# EAGLE design recieving end copy-1 (EAGLE 6.3)
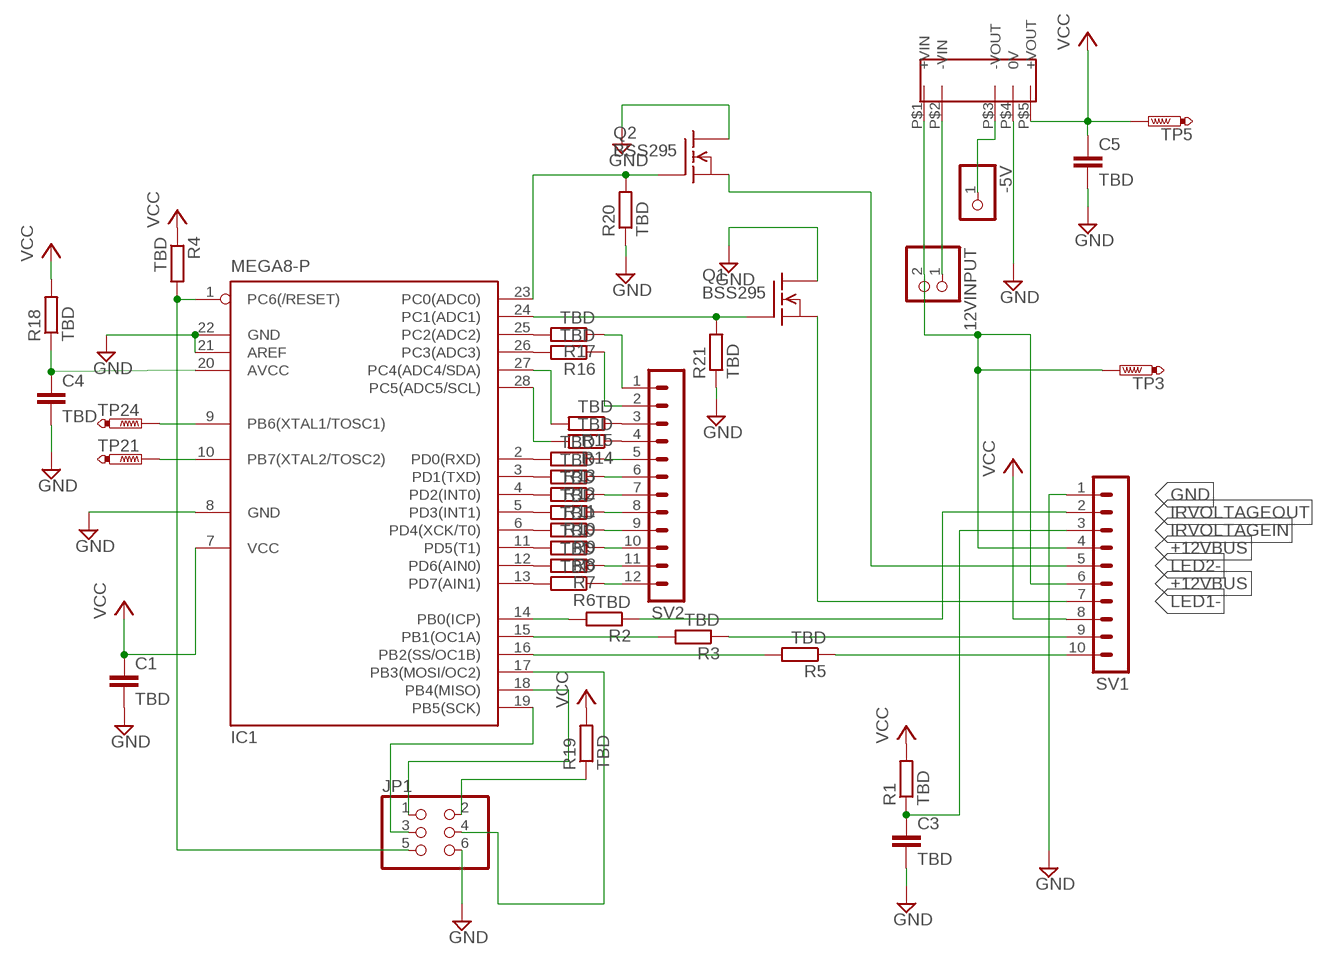
[diagram p0: schematic, sheet 1]

## Parts
12VINPUT  PINHD-1X2  [1X02]
-5V  PINHD-1X1  [1X01]
C1  TBD  C-EUC0805  [C0805]
C3  TBD  C-EUC0805  [C0805]
C4  TBD  C-EUC0805  [C0805]
C5  TBD  C-EUC0805  [C0805]
IC1  MEGA8-P  [DIL28-3]
JP1  PINHD-2X3  [2X03]
Q1  BSS295  [TO92]
Q2  BSS295  [TO92]
R1  TBD  R-EU_R0805  [R0805]
R2  TBD  R-EU_R0805  [R0805]
R3  TBD  R-EU_R0805  [R0805]
R4  TBD  R-EU_R0805  [R0805]
R5  TBD  R-EU_R0805  [R0805]
R6  TBD  R-EU_R0805  [R0805]
R7  TBD  R-EU_R0805  [R0805]
R8  TBD  R-EU_R0805  [R0805]
R9  TBD  R-EU_R0805  [R0805]
R10  TBD  R-EU_R0805  [R0805]
R11  TBD  R-EU_R0805  [R0805]
R12  TBD  R-EU_R0805  [R0805]
R13  TBD  R-EU_R0805  [R0805]
R14  TBD  R-EU_R0805  [R0805]
R15  TBD  R-EU_R0805  [R0805]
R16  TBD  R-EU_R0805  [R0805]
R17  TBD  R-EU_R0805  [R0805]
R18  TBD  R-EU_R0805  [R0805]
R19  TBD  R-EU_R0805  [R0805]
R20  TBD  R-EU_R0805  [R0805]
R21  TBD  R-EU_R0805  [R0805]
SV1  MA10-1  [MA10-1]
SV2  MA12-1  [MA12-1]
TP3  PTR1B1,27  [B1,27]
TP5  PTR1B1,27  [B1,27]
TP21  PTR1B1,27  [B1,27]
TP24  PTR1B1,27  [B1,27]
U$1  NKA1205SC  [NKA1205SC]

## Nets
0VBUS: 12VINPUT.1 U$1.P$2(-VIN)
+12VBUS: 12VINPUT.2 SV1.4 SV1.6 TP3.TP U$1.P$1(+VIN)
GND: C1.2 C3.2 C4.2 C5.2 IC1.8(GND) IC1.21(AREF) IC1.22(GND) JP1.6 Q1.2(D) Q2.2(D) R20.1 R21.1 SV1.1 U$1.P$4(0V)
IRVOLTAGEIN: C3.1 R1.1 SV1.3
IRVOLTAGEOUT: R2.1 SV1.2
LED1-: Q1.3(S) SV1.7
LED2-: Q2.3(S) SV1.5
N$1: IC1.24(PC1(ADC1)) Q1.1(G) R21.2
N$2: R3.1 SV1.9
N$3: R17.1 SV2.1
N$4: R16.1 SV2.2
N$5: IC1.17(PB3(MOSI/OC2)) JP1.4
N$6: IC1.27(PC4(ADC4/SDA)) R15.2
N$7: IC1.28(PC5(ADC5/SCL)) R14.2
N$8: IC1.23(PC0(ADC0)) Q2.1(G) R20.2
N$9: R5.1 SV1.10
N$10: R13.1 SV2.5
N$11: IC1.14(PB0(ICP)) R2.2
N$12: R12.1 SV2.6
N$13: R11.1 SV2.7
N$14: R10.1 SV2.8
N$15: R9.1 SV2.9
N$16: R8.1 SV2.10
N$17: R7.1 SV2.11
N$18: IC1.15(PB1(OC1A)) R3.2
N$19: IC1.16(PB2(SS/OC1B)) R5.2
N$22: R6.1 SV2.12
N$23: IC1.25(PC2(ADC2)) R17.2
N$24: IC1.26(PC3(ADC3)) R16.2
N$25: R15.1 SV2.3
N$26: R14.1 SV2.4
N$27: IC1.2(PD0(RXD)) R13.2
N$28: IC1.6(PD4(XCK/T0)) R9.2
N$29: IC1.18(PB4(MISO)) JP1.1
N$30: IC1.19(PB5(SCK)) JP1.3
N$31: IC1.9(PB6(XTAL1/TOSC1)) TP24.TP
N$32: IC1.10(PB7(XTAL2/TOSC2)) TP21.TP
N$33: IC1.11(PD5(T1)) R8.2
N$34: IC1.12(PD6(AIN0)) R7.2
N$35: IC1.1(PC6(/RESET)) JP1.5 R4.2
N$36: IC1.13(PD7(AIN1)) R6.2
N$37: IC1.3(PD1(TXD)) R12.2
N$38: IC1.4(PD2(INT0)) R11.2
N$39: IC1.5(PD3(INT1)) R10.2
N$41: C4.1 IC1.20(AVCC) R18.1
N$43: JP1.2 R19.1
N$46: -5V.1 U$1.P$3(-VOUT)
VCC: C1.1 C5.1 IC1.7(VCC) R1.2 R4.1 R18.2 R19.2 SV1.8 TP5.TP U$1.P$5(+VOUT)

## Library data of the parts
12VINPUT = pinhead:PINHD-1X2: PIN HEADER
-5V = pinhead:PINHD-1X1: PIN HEADER
C1 C3-C5 = rcl:C-EU: CAPACITOR, European symbol
IC1 = atmel:MEGA8-P: MICROCONTROLLER 8 Kbytes FLASH, 1 kbytes SRAM, 512 bytes EEPROM, USART, 4-channel 10 bit ADC, 2-channel 8 bit ADC Pin compatible with Atmega48, ATMega88, ATMega168 Source: avr.lbr; OC_FARNELL: unknown; OC_NEWARK: unknown
JP1 = pinhead:PINHD-2X3: PIN HEADER
Q1 Q2 = transistor-fet:BSS295: N-Channel Enhancement MOSFET not checked
R1-R21 = resistor:R-EU_: RESISTOR, European symbol
SV1 = con-lstb:MA10-1: PIN HEADER; OC_FARNELL: unknown; OC_NEWARK: unknown
SV2 = con-lstb:MA12-1: PIN HEADER; OC_FARNELL: unknown; OC_NEWARK: unknown
TP3 TP5 TP21 TP24 = testpad:PTR1: TEST PIN
U$1 = nka1205sc:NKA1205SC

## Board
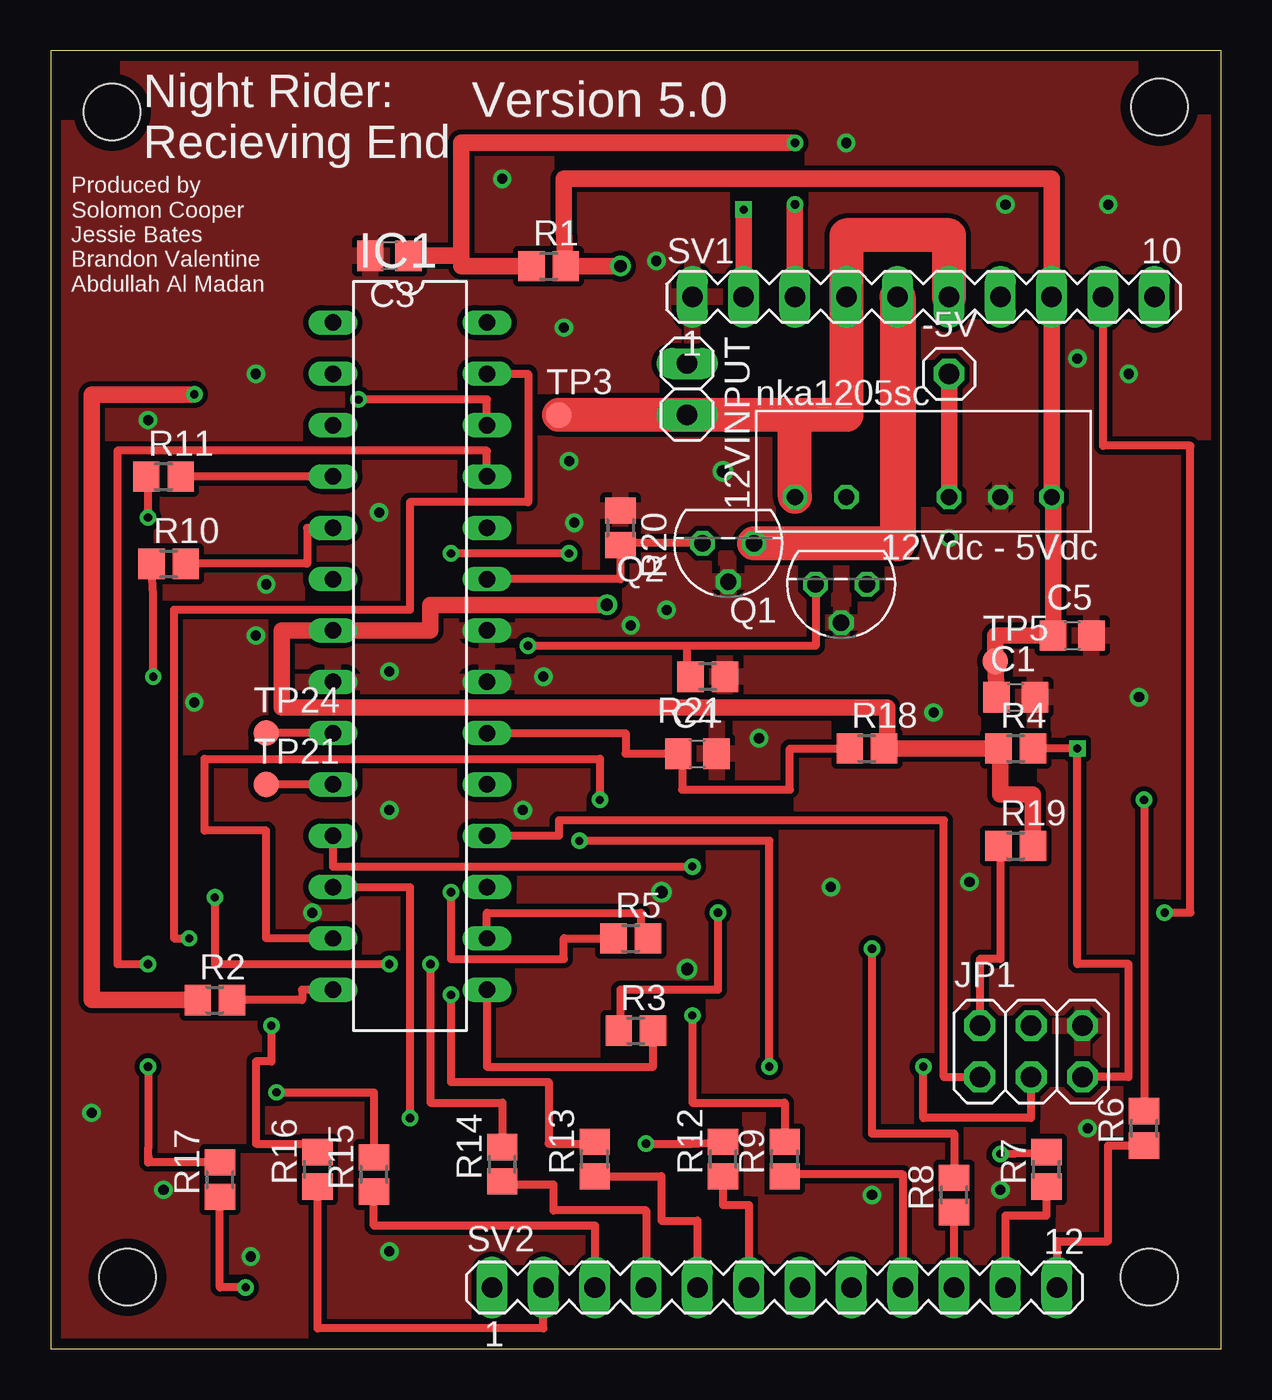
[diagram p1: board, top side]
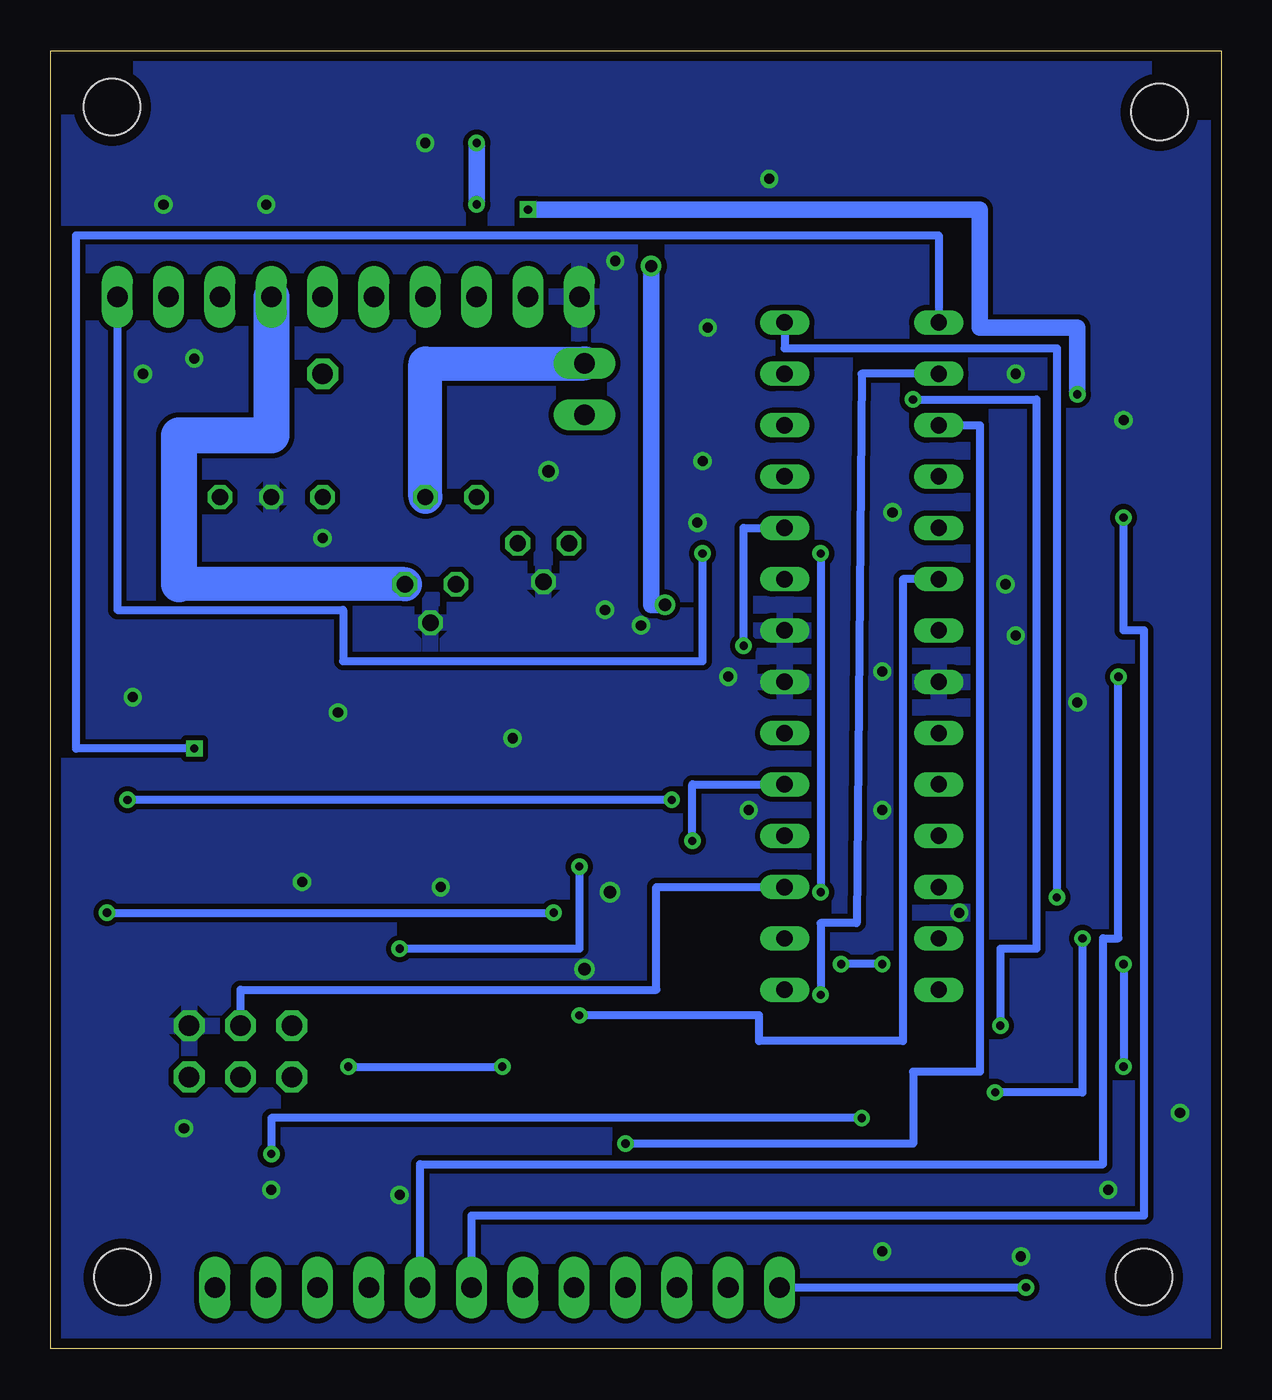
[diagram p2: board, bottom side, seen from below]

Size 57.91 x 64.26 mm. Coordinates in mm from the lower left corner, seen from the top.
Outline: 0,0 57.91,0 57.91,64.26 0,64.26 0,0
Copper layers (1*16): Top 0.0178mm / dielectric 59mil / Bottom 0.0178mm
Design rules "sunstone-valueproto": minimum track width 7mil, minimum drill 16mil, track to track 7mil, track to pad 7mil, pad to pad 7mil, via to via 7mil, smd to smd 7mil, copper to edge 20mil, drill to drill 16mil, minimum pad ring 8mil, minimum via ring 8mil, stop-mask expansion 3mil, vias tented up to drill 0mil, thermal gap 10mil
Holes 2.8 mm at 3.05,61.21 54.86,61.47 54.36,3.56 3.81,3.56

### Footprints (pad centres in the part's own frame; a part is rotated, then mirrored left to right if it is on the bottom)
1X02 = drill 1.016 long: 1 -1.27,0; 2 1.27,0
1X01 = drill 1.016 octagon: 1 0,0
C0805 = smd 1.3 x 1.5: 1 -0.95,0; 2 0.95,0
DIL28-3 = drill 0.813 long: 1 -16.51,-3.81; 2 -13.97,-3.81; 3 -11.43,-3.81; 4 -8.89,-3.81; 5 -6.35,-3.81; 6 -3.81,-3.81; 7 -1.27,-3.81; 8 1.27,-3.81; 9 3.81,-3.81; 10 6.35,-3.81; 11 8.89,-3.81; 12 11.43,-3.81; 13 13.97,-3.81; 14 16.51,-3.81; 15 16.51,3.81; 16 13.97,3.81; 17 11.43,3.81; 18 8.89,3.81; 19 6.35,3.81; 20 3.81,3.81; 21 1.27,3.81; 22 -1.27,3.81; 23 -3.81,3.81; 24 -6.35,3.81; 25 -8.89,3.81; 26 -11.43,3.81; 27 -13.97,3.81; 28 -16.51,3.81
2X03 = drill 1.016 octagon: 1 -2.54,-1.27; 2 -2.54,1.27; 3 0,-1.27; 4 0,1.27; 5 2.54,-1.27; 6 2.54,1.27
TO92 = drill 0.813 octagon: 1 1.27,0; 2 0,1.905; 3 -1.27,0
R0805 = smd 1.3 x 1.5: 1 -0.85,0; 2 0.85,0
MA10-1 = drill 1.016 long: 1 -11.43,0; 2 -8.89,0; 3 -6.35,0; 4 -3.81,0; 5 -1.27,0; 6 1.27,0; 7 3.81,0; 8 6.35,0; 9 8.89,0; 10 11.43,0
MA12-1 = drill 1.016 long: 1 -13.97,0; 2 -11.43,0; 3 -8.89,0; 4 -6.35,0; 5 -3.81,0; 6 -1.27,0; 7 1.27,0; 8 3.81,0; 9 6.35,0; 10 8.89,0; 11 11.43,0; 12 13.97,0
B1,27 = smd 1.27 x 1.27: TP 0,0
NKA1205SC = drill 0.8 octagon: P$1 -6.35,-1.27; P$2 -3.81,-1.27; P$3 1.27,-1.27; P$4 3.81,-1.27; P$5 6.35,-1.27

### Placement (x,y rotation side)
12VINPUT  31.5,47.5 270 top
-5V  44.45,48.26 0 top
C1  47.75,32.26 0 top
C3  16.76,54.1 180 top
C4  32,29.46 0 top
C5  50.55,35.31 0 top
IC1  17.78,34.29 270 top
JP1  48.51,14.73 0 top
Q1  39.12,37.85 180 top
Q2  33.53,39.88 180 top
R1  24.64,53.59 0 top
R2  8.13,17.27 0 top
R3  28.96,15.75 0 top
R4  47.75,29.72 0 top
R5  28.7,20.32 0 top
R6  54.1,10.92 90 top
R7  49.28,8.89 90 top
R8  44.7,7.62 90 top
R9  36.32,9.4 90 top
R10  5.84,38.86 0 top
R11  5.59,43.18 0 top
R12  33.27,9.4 90 top
R13  26.92,9.4 90 top
R14  22.35,9.14 90 top
R15  16,8.64 90 top
R16  13.21,8.89 90 top
R17  8.38,8.38 90 top
R18  40.39,29.72 0 top
R19  47.75,24.89 0 top
R20  28.19,40.64 270 top
R21  32.51,33.27 180 top
SV1  43.18,52.07 0 top
SV2  35.81,3.05 0 top
TP3  25.15,46.23 0 top
TP5  46.74,34.04 0 top
TP21  10.67,27.94 0 top
TP24  10.67,30.48 0 top
U$1  43.18,43.43 0 top

### Tracks (layer width: path | path; a pad name or v marks a point on that pad's centre or on a via)
0VBUS
  Bottom 1.676: U$1.P$2 39.37,48.77 12VINPUT.1
+12VBUS
  Top 1.676: U$1.P$1 36.83,46.23 | 36.83,46.23 12VINPUT.2 TP3.TP | 36.83,46.23 39.37,46.23 SV1.4 39.37,55.12 44.45,55.12 SV1.6
GND  (via drill 0.5, 0.61)
  other vias: 39.37,59.69 4.83,45.97 52.32,56.64 44.45,40.13 53.34,48.26 25.65,43.94 47.24,56.64 33.27,43.43 50.8,49.02 22.35,57.91 2.03,11.68 30.48,36.58 10.16,48.26 25.91,40.89 43.69,31.5 35.05,30.23 38.61,22.86 53.85,32.26 24.38,33.27 45.47,23.11 23.37,26.67 10.67,37.85 10.16,35.31 7.11,32 31.5,18.8 12.95,21.59 46.99,7.87 40.64,7.62 16.76,4.83 9.91,4.57 5.59,7.87 51.31,10.92 29.97,53.85 25.4,50.55 16.76,33.53 16.76,26.67 16.26,41.4 30.23,22.61 28.7,35.81
  pour Bottom (isolate 0.254): 0,0 57.66,-0.25 57.91,64.26 0,64.01
  pour Top (isolate 0.254): 0,0 57.66,-0.25 57.91,64.26 0,64.01
IRVOLTAGEIN  (via drill 0.41)
  Top 0.178: 23.88,54.1 23.79,54.1 R1.1
  Top 0.813: SV1.3 v36.83,56.64 | v36.83,59.69 20.32,59.69 20.32,54.1 | C3.1 20.32,54.1 | 20.32,54.1 20.32,53.59 R1.1
  Bottom 0.813: v36.83,56.64 v36.83,59.69
IRVOLTAGEOUT  (via drill 0.41)
  Top 0.813: SV1.2 v34.29,56.39 | v7.11,47.24 2.03,47.24 2.03,17.27 R2.1
  Bottom 0.813: v34.29,56.39 11.94,56.39 11.94,50.55 7.11,50.55 v7.11,47.24
LED1-
  Bottom 1.676: Q1.3 51.56,37.85
  Bottom 1.778: SV1.7 46.99,45.21 51.56,45.21 51.56,37.85
LED2-
  Top 1.676: Q2.3 41.91,39.88
  Top 1.778: SV1.5 41.91,39.88
N$1  (via drill 0.41)
  Top 0.406: R21.2 31.5,33.02 31.5,34.8 | 31.5,34.8 v23.62,34.8 | Q1.1 37.85,34.8 31.5,34.8
  Bottom 0.406: IC1.24 23.62,40.64 v23.62,34.8
N$2  (via drill 0.41)
  Top 0.406: v33.02,21.59 33.02,17.78 28.19,17.78 28.19,16.51 R3.1 | v55.12,21.59 56.39,21.59 56.39,44.7 52.07,44.7 SV1.9
  Bottom 0.406: v55.12,21.59 v33.02,21.59
N$3  (via drill 0.41)
  Top 0.406: v9.65,3.05 8.38,3.05 R17.1
  Bottom 0.406: SV2.1 v9.65,3.05
N$4
  Top 0.406: R16.1 13.21,1.02 24.38,1.02 SV2.2
N$5
  Bottom 0.406: IC1.17 27.94,22.86 27.94,17.78 48.51,17.78 JP1.4
N$6  (via drill 0.41)
  Top 0.406: R15.2 16,12.7 v11.18,12.7 | v6.86,20.32 6.1,20.32 6.1,36.58 17.78,36.58 17.78,41.91 23.62,41.91 23.62,48.26 IC1.27
  Bottom 0.406: v6.86,20.32 6.86,12.7 v11.18,12.7
N$7  (via drill 0.41)
  Top 0.406: v18.8,19.05 18.8,12.19 22.35,12.19 R14.2 | v16.76,19.05 8.13,19.05 v8.13,22.35
  Bottom 0.406: v16.76,19.05 v18.8,19.05 | v8.13,22.35 8.13,49.53 21.59,49.53 IC1.28
N$8
  Top 0.406: IC1.23 28.19,38.1 R20.2 28.19,39.88 Q2.1
N$9  (via drill 0.41)
  Top 0.178: 27.94,20.32 R5.1
  Top 0.406: R5.1 25.4,20.32 25.4,19.3 19.81,19.3 v19.81,22.61 | v25.65,39.37 v19.81,39.37
  Bottom 0.406: v19.81,39.37 v19.81,22.61 | SV1.10 54.61,36.58 43.43,36.58 43.43,34.04 25.65,34.04 v25.65,39.37
N$10
  Top 0.406: R13.1 30.23,8.55 30.23,6.35 32,6.35 SV2.5
N$11
  Top 0.406: IC1.14 12.45,17.78 12.45,17.27 R2.2
N$12
  Top 0.406: R12.1 33.27,7.11 34.54,7.11 SV2.6
N$13  (via drill 0.41)
  Top 0.406: v4.83,41.15 4.83,43.18 R11.1
  Bottom 0.406: v4.83,41.15 4.83,35.56 3.81,35.56 3.81,6.6 37.08,6.6 SV2.7
N$14  (via drill 0.41)
  Top 0.406: v5.08,33.27 5.08,37.34 R10.1
  Bottom 0.406: v5.08,33.27 5.08,20.32 5.84,20.32 5.84,9.14 39.62,9.14 SV2.8
N$15
  Top 0.406: R9.1 36.32,8.64 42.16,8.64 SV2.9
N$16
  Top 0.406: SV2.10 R8.1
N$17
  Top 0.406: R7.1 49.28,6.6 47.24,6.6 SV2.11
N$18
  Top 0.406: IC1.15 21.59,13.97 29.81,13.97 R3.2
N$19
  Top 0.178: 29.21,20.32 R5.2
  Top 0.406: 29.21,20.32 29.21,21.59 21.59,21.59 IC1.16
N$22
  Top 0.406: R6.1 52.32,10.07 52.32,5.33 49.78,5.33 SV2.12
N$23  (via drill 0.41)
  Top 0.178: 4.83,9.91 5.08,9.14
  Top 0.406: v4.83,13.97 4.83,9.91 4.83,9.23 R17.2 | v4.83,19.05 3.3,19.05 3.3,44.45 21.59,44.45 IC1.25
  Bottom 0.406: v4.83,19.05 v4.83,13.97
N$24  (via drill 0.41)
  Top 0.178: 12.7,10.16 R16.2
  Top 0.406: 12.7,10.16 10.16,10.16 10.16,14.22 10.92,14.22 v10.92,16 | v15.24,46.99 21.59,46.99 IC1.26
  Bottom 0.406: v10.92,16 10.92,19.81 9.14,19.81 9.14,46.99 v15.24,46.99
N$25
  Top 0.406: R15.1 16,6.1 26.92,6.1 SV2.3
N$26
  Top 0.406: R14.1 22.35,8.13 24.89,8.13 24.89,6.86 29.46,6.86 SV2.4
N$27  (via drill 0.41)
  Top 0.178: 26.67,10.16 R13.2
  Top 0.406: 26.67,10.16 24.64,10.16 24.64,13.21 19.81,13.21 v19.81,17.53
  Bottom 0.406: v19.81,17.53 19.81,21.08 18.03,21.08 17.78,48.26 IC1.2
N$28  (via drill 0.41)
  Top 0.406: v31.75,16.51 31.75,12.19 36.32,12.19 R9.2
  Bottom 0.406: v31.75,16.51 22.86,16.51 22.86,15.24 15.75,15.24 15.75,38.1 IC1.6
N$29
  Top 0.406: IC1.18 25.15,25.4 25.15,26.16 44.2,26.16 44.2,13.46 JP1.1
N$30  (via drill 0.41)
  Top 0.406: v26.16,25.15 35.56,25.15 v35.56,13.97 | v43.18,13.97 43.18,11.43 48.51,11.43 JP1.3
  Bottom 0.406: IC1.19 26.16,27.94 v26.16,25.15 | v43.18,13.97 v35.56,13.97
N$31
  Top 0.406: IC1.9 TP24.TP
N$32
  Top 0.406: IC1.10 TP21.TP
N$33  (via drill 0.41)
  Top 0.406: v40.64,19.81 40.64,10.67 44.7,10.67 R8.2 | v31.75,23.88 13.97,23.88 IC1.11
  Bottom 0.406: v40.64,19.81 31.75,19.81 v31.75,23.88
N$34  (via drill 0.41)
  Top 0.406: v17.78,11.43 17.78,22.86 IC1.12 | v46.99,9.65 R7.2
  Bottom 0.406: v46.99,9.65 46.99,11.43 v17.78,11.43
N$35  (via drill 0.41)
  Top 0.178: 48.51,29.72 R4.2
  Top 0.406: R4.2 v50.8,29.72 50.8,19.05 53.34,19.05 53.34,13.46 JP1.5
  Bottom 0.406: IC1.1 13.97,55.12 56.64,55.12 56.64,29.72 v50.8,29.72
N$36  (via drill 0.41)
  Top 0.406: v27.18,27.18 27.18,29.21 7.62,29.21 7.62,25.65 10.67,25.65 10.67,20.32 IC1.13 | v54.1,27.18 R6.2
  Bottom 0.406: v27.18,27.18 v54.1,27.18
N$37  (via drill 0.41)
  Top 0.406: v29.46,10.16 31.75,10.16 R12.2
  Bottom 0.406: v29.46,10.16 15.24,10.16 15.24,13.72 11.94,13.72 11.94,45.72 IC1.3
N$38
  Top 0.406: IC1.4 R11.2
N$39
  Top 0.406: R10.2 12.7,38.86 12.7,40.64 IC1.5
N$41
  Top 0.406: IC1.20 28.45,30.48 28.45,29.46 C4.1 31.24,29.97 31.24,27.69 36.58,27.69 36.58,29.72 R18.1
N$43
  Top 0.406: R19.1 46.99,24.89 46.99,19.3 45.97,19.3 JP1.2
N$46
  Top 0.813: -5V.1 U$1.P$3
VCC  (via drill 0.61)
  Top 0.813: C1.1 TP5.TP 46.74,35.31 C5.1 49.6,42.16 U$1.P$5 SV1.8 49.53,57.91 25.4,57.91 25.4,55.37 R1.2 v28.19,53.59 | 41.4,29.72 R4.1 46.99,29.72 46.99,27.43 48.6,27.43 R19.2 | R18.2 41.4,29.72 | 41.4,29.72 41.4,31.75 11.43,31.75 11.43,35.56 IC1.7 18.8,35.56 18.8,36.83 v27.52,36.83
  Bottom 0.813: v28.19,53.59 28.19,36.83 v27.52,36.83

### Text on the board
tPlace: Version 5.0 | Night Rider: / Recieving End | Produced by / Solomon Cooper / Jessie Bates / Brandon Valentine / Abdullah Al Madan